# EAGLE design ECGSensor (EAGLE 7.5.0)

## Sheet 1 of 2
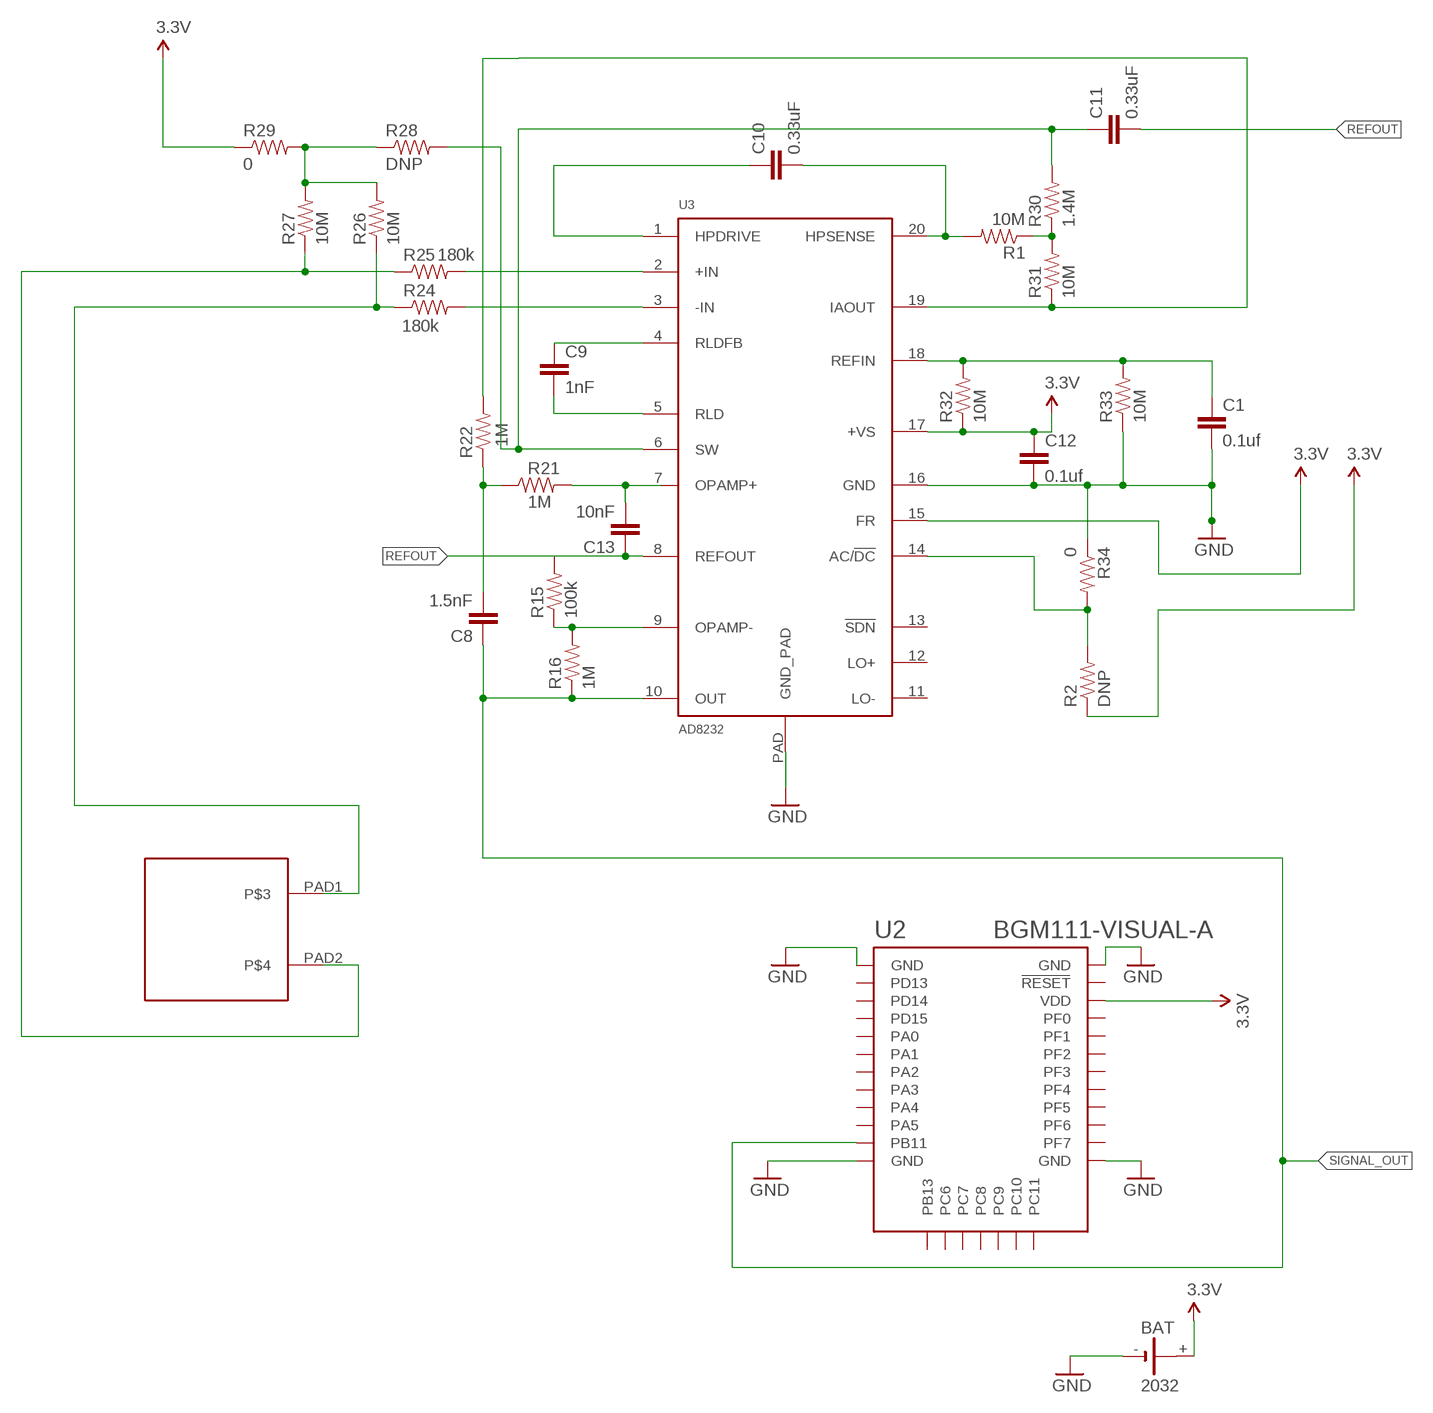
[diagram p0: schematic, sheet 1]

### Parts
BAT  2032  [KZH20SMD]
C1  0.1uf  CAP0603-CAP  [0603-CAP]
C8  1.5nF  CAP0603-CAP  [0603-CAP]
C9  1nF  CAP0603-CAP  [0603-CAP]
C10  0.33uF  CAP0805  [0805]
C11  0.33uF  CAP0805  [0805]
C12  0.1uf  CAP0603-CAP  [0603-CAP]
C13  10nF  CAP0603-CAP  [0603-CAP]
R1  10M  RESISTOR0603-RES  [0603-RES]
R2  DNP  0OHM1/10W5%(0603)  [0603]
R15  100k  RESISTOR0603-RES  [0603-RES]
R16  1M  RESISTOR0603-RES  [0603-RES]
R21  1M  RESISTOR0603-RES  [0603-RES]
R22  1M  RESISTOR0603-RES  [0603-RES]
R24  180k  RESISTOR0603-RES  [0603-RES]
R25  180k  RESISTOR0603-RES  [0603-RES]
R26  10M  RESISTOR0603-RES  [0603-RES]
R27  10M  RESISTOR0603-RES  [0603-RES]
R28  DNP  0OHM1/10W5%(0603)  [0603]
R29  0  0OHM1/10W5%(0603)  [0603]
R30  1.4M  RESISTOR0603-RES  [0603-RES]
R31  10M  RESISTOR0603-RES  [0603-RES]
R32  10M  RESISTOR0603-RES  [0603-RES]
R33  10M  RESISTOR0603-RES  [0603-RES]
R34  0  0OHM1/10W5%(0603)  [0603]
U2  BGM111-VISUAL-A  [BGM111-A]
U3  AD8232  [LFCSP_20]
U$1  CPAD  [SNAPPAD]

### Nets
3.3V: BAT.+ C12.1 R2.1 R29.1 R32.1 U2.VDD U3.15(FR) U3.17(+VS)
GND: BAT.- C1.2 C12.2 R33.1 R34.1 U2.GND U2.GND@2(GND) U2.GND@3(GND) U2.GND@4(GND) U3.16(GND) U3.PAD(GND_PAD)
LA: U$1.PAD2
N$2: C10.1 U3.1(HPDRIVE)
N$6: C10.2 R1.2 U3.20(HPSENSE)
N$7: R1.1 R30.1 R31.2
N$8: C11.1 R28.2 R30.2 U3.6(SW)
N$10: C1.1 R32.2 R33.2 U3.18(REFIN)
N$11: R22.2 R31.1 U3.19(IAOUT)
N$17: C9.2 U3.5(RLD)
N$19: R2.2 R34.2 U3.14(AC/!DC)
N$20: C8.2 R21.1 R22.1
N$21: C13.2 R21.2
N$22: C9.1 U3.4(RLDFB)
N$23: R24.2 U3.3(-IN)
N$24: R25.2 U3.2(+IN)
N$25: R25.1 R27.1
N$26: R24.1 R26.1 U$1.PAD1
N$28: R26.2 R27.2 R28.1 R29.2
N$29: R15.1 R16.2 U3.9(OPAMP-)
N$31: C13.1 R15.2 U3.8(REFOUT)
N$33: C11.2
SIGNAL_OUT: C8.1 R16.1 U2.PB11 U3.10(OUT)
Unconnected: U2.PA0 U2.PA1 U2.PA2 U2.PA3 U2.PA4 U2.PA5 U2.PB13 U2.PC6 U2.PC7 U2.PC8 U2.PC9 U2.PC10 U2.PC11 U2.PD13 U2.PD14 U2.PD15 U2.PF0 U2.PF1 U2.PF2 U2.PF3 U2.PF4 U2.PF5 U2.PF6 U2.PF7 U2.RESET U3.7(OPAMP+) U3.11(LO-) U3.12(LO+) U3.13(!SDN)

## Sheet 2 of 2

## Library data of the parts
BAT = SMTU-2032-1:2032
C1 C8-C13 = SparkFun-Passives:CAP: Capacitor Standard 0603 ceramic capacitor, and 0.1" leaded capacitor.
R1 R15 R16 R21 R22 R24-R27 R30-R33 = SparkFun-Passives:RESISTOR: Resistor Basic schematic elements and footprints for 0603, 1206, and PTH resistors.
R2 R28 = SparkFun-Resistors:0OHM1/10W5%(0603): RES-08609; PROD_ID: RES-08609; VALUE: 0
R29 R34 = SparkFun-Resistors:0OHM1/10W5%(0603): RES-08609; PROD_ID: RES-08609
U2 = sf-bluegiga:BGM111-VISUAL: Bluetooth 4.1 (4.2 ready) low-energy module (Bluetooth Smart) - BGM111-A variant has an on-module ceramic chip antenna. BGM111-A variant includes keepout/restrict area. Antenna edge of the module should be flush up against the edge of the PCB. See datasheet for variant layout details. IT IS EXTREMELY IMPORTANT THAT YOU FOLLOW THE LAYOUT GUIDELINES FOR THIS MODULE IN ORDER TO ENSURE MAXIMUM RANGE. THIS MEANS THAT YOU NEED A SOLID GROUND PLANE EXTENDING IDEALLY 17 mm ON THE LEFT AND RIGHT SIDES OF THE MODULE, AS SHOWN IN THE DATASHEET. The Silicon Labs Blue Gecko BGM111 Bluetooth® Smart module integrates our next generation wireless SoC with a complete Bluetooth Smart software stack and antenna to provide a complete, pre-certified plug-and-play Bluetooth Smart solution. It solves one of the major customer roadblocks for fast time-to-market as it integrates antenna, software and RF certifications, saving months of engineering effort and testing. https://www.silabs.com/products/wireless/bluetooth/Pages/BGM111-bluetooth-smart-module.aspx https://github.com/jrowberg/sf-oshw Last updated 2015-09-02 by Jeff Rowberg <jeff@rowberg.net>; ANTENNA: On-module ceramic chip antenna
U3 = AD8232:AD8232
U$1 = Copper pad:CPAD

## Board
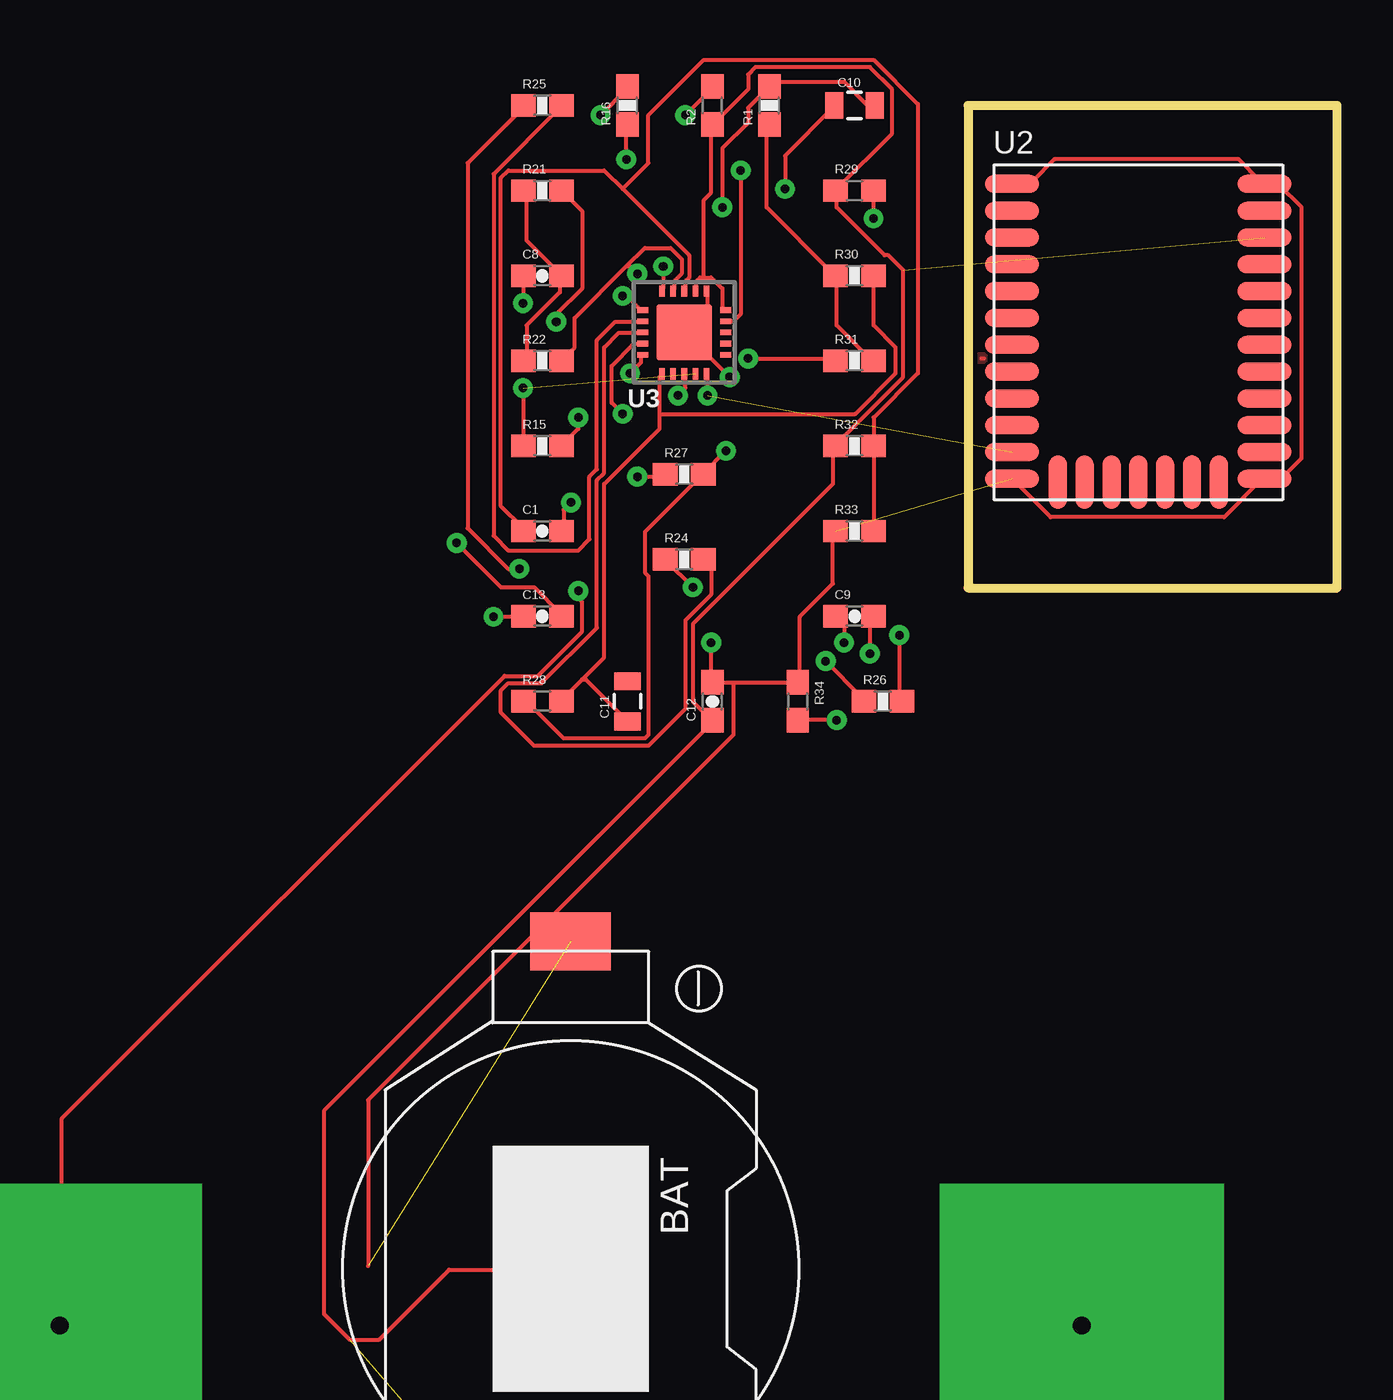
[diagram p1: board, top side]
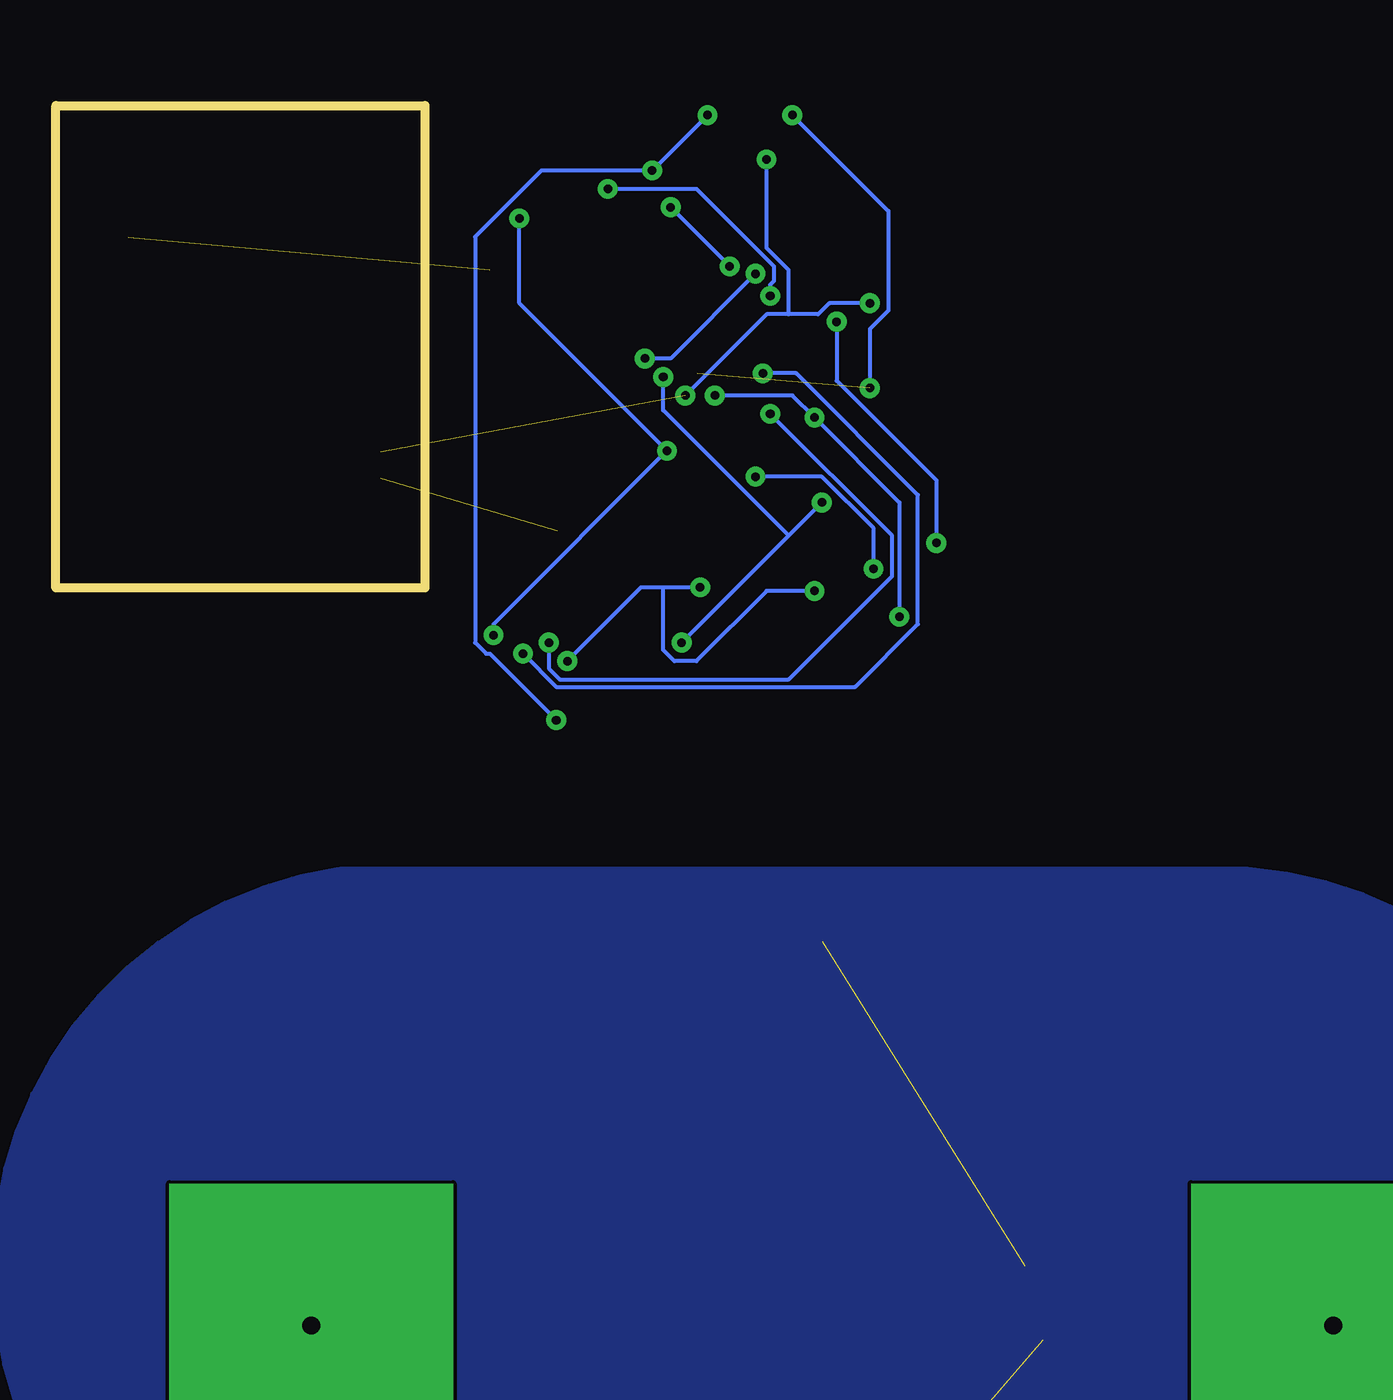
[diagram p2: board, bottom side, seen from below]

Size 16.51 x 21.59 mm. Coordinates in mm from the lower left corner, seen from the top.
Outline: 0,21.59 0,0 16.51,0 16.51,21.59 0,21.59
Copper layers (1*16): Top 0.035mm / dielectric 1.5mm / Bottom 0.035mm
Design rules "default": minimum track width 7mil, minimum drill 15mil, track to track 6mil, track to pad 8mil, pad to pad 8mil, via to via 8mil, smd to smd 8mil, copper to edge 8mil, drill to drill 8mil, minimum pad ring 12mil, minimum via ring 10mil, stop-mask expansion 4mil, vias tented up to drill 20mil, thermal gap 10mil

### Footprints (pad centres in the part's own frame; a part is rotated, then mirrored left to right if it is on the bottom)
KZH20SMD = smd 2.6 x 3.6: + 14.65,0; - -14.65,0
0603-CAP = smd 1.1 x 1: 1 -0.85,0; 2 0.85,0
0805 = smd 0.8 x 1.2: 1 -0.9,0; 2 0.9,0
0603-RES = smd 1.1 x 1: 1 -0.85,0; 2 0.85,0
0603 = smd 1.1 x 1: 1 -0.85,0; 2 0.85,0
BGM111-A = smd 2.4 x 0.8: GND -5.65,6.65; GND@2 -5.65,-6.55; GND@3 5.65,-6.55; GND@4 5.65,6.65; PA0 -5.65,1.85; PA1 -5.65,0.65; PA2 -5.65,-0.55; PA3 -5.65,-1.75; PA4 -5.65,-2.95; PA5 -5.65,-4.15; PB11 -5.65,-5.35; PD13 -5.65,5.45; PD14 -5.65,4.25; PD15 -5.65,3.05; PF0 5.65,-5.35; PF1 5.65,-4.15; PF2 5.65,-2.95; PF3 5.65,-1.75; PF4 5.65,-0.55; PF5 5.65,0.65; PF6 5.65,1.85; PF7 5.65,3.05; RESET 5.65,5.45; VDD 5.65,4.25 | smd 0.8 x 2.4: PB13 -3.6,-6.7; PC6 -2.4,-6.7; PC7 -1.2,-6.7; PC8 0,-6.7; PC9 1.2,-6.7; PC10 2.4,-6.7; PC11 3.6,-6.7
LFCSP_20 = smd 0.5 x 0.25: 1 -1.85,1; 2 -1.85,0.5; 3 -1.85,0; 4 -1.85,-0.5; 5 -1.85,-1; 11 1.85,-1; 12 1.85,-0.5; 13 1.85,0; 14 1.85,0.5; 15 1.85,1 | smd 0.25 x 0.5: 6 -1,-1.85; 7 -0.5,-1.85; 8 0,-1.85; 9 0.5,-1.85; 10 1,-1.85; 16 1,1.85; 17 0.5,1.85; 18 0,1.85; 19 -0.5,1.85; 20 -1,1.85 | smd 2.5 x 2.5: PAD 0,0
SNAPPAD = drill 0.8 pad 12.7 square: PAD1 -50.8,1.27; PAD2 -5.08,1.27

### Placement (x,y rotation side)
BAT  -17.78,-30.48 270 top  (outside the outline)
C1  -19.05,2.54 0 top  (outside the outline)
C8  -19.05,13.97 0 top  (outside the outline)
C9  -5.08,-1.27 0 top  (outside the outline)
C10  -5.08,21.59 0 top  (outside the outline)
C11  -15.24,-5.08 90 top  (outside the outline)
C12  -11.43,-5.08 90 top  (outside the outline)
C13  -19.05,-1.27 0 top  (outside the outline)
R1  -8.89,21.59 90 top  (outside the outline)
R2  -11.43,21.59 90 top  (outside the outline)
R15  -19.05,6.35 0 top  (outside the outline)
R16  -15.24,21.59 90 top  (outside the outline)
R21  -19.05,17.78 0 top  (outside the outline)
R22  -19.05,10.16 0 top  (outside the outline)
R24  -12.7,1.27 0 top  (outside the outline)
R25  -19.05,21.59 0 top  (outside the outline)
R26  -3.81,-5.08 0 top  (outside the outline)
R27  -12.7,5.08 0 top  (outside the outline)
R28  -19.05,-5.08 0 top  (outside the outline)
R29  -5.08,17.78 0 top  (outside the outline)
R30  -5.08,13.97 0 top  (outside the outline)
R31  -5.08,10.16 0 top  (outside the outline)
R32  -5.08,6.35 0 top  (outside the outline)
R33  -5.08,2.54 0 top  (outside the outline)
R34  -7.62,-5.08 270 top  (outside the outline)
U2  7.62,11.43 0 top
U3  -12.7,11.43 0 top  (outside the outline)
U$1  10.16,-34.29 0 top  (outside the outline)

### Tracks (layer width: path | path; a pad name or v marks a point on that pad's centre or on a via)
3.3V  (2 unrouted)
  Top 0.178: -11.82,13.89 -11.99,13.89 -12.15,13.73 -12.15,13.4 U3.17 | -11.82,13.89 -11.49,13.89 -11,13.4 -11,12.41 U3.15 | -11.82,13.89 -11.82,17.36 -11.49,17.69 -11.49,20.66 R2.1 -11.33,20.83 -9.84,22.31 -9.84,22.97 -9.51,23.3 -4.39,23.3 -3.4,22.31 -3.4,20.33 -5.88,17.86 R29.1 -5.88,17.69 -5.88,17.03 -3.73,14.88 -3.57,14.88 -2.91,14.22 -2.91,9.44 -5.88,6.46 R32.1 -6.05,6.3 -6.05,4.65 -12.32,-1.63 -12.32,-5.09 -11.49,-5.92 C12.1 -11.49,-6.08 -28.83,-23.42 -28.83,-32.5 -27.67,-33.66 -26.35,-33.66 -23.22,-30.52 -16.61,-30.52
GND  (via drill 0.38)  (2 unrouted)
  Top 0.178: U2.GND 2.04,18.19 2.87,18.19 3.86,19.18 12.12,19.18 13.11,18.19 U2.GND@4 13.27,18.02 13.93,18.02 14.92,17.03 14.92,5.8 14.1,4.98 13.27,4.98 U2.GND@3 13.11,4.81 11.45,3.16 3.7,3.16 2.04,4.81 U2.GND@2 | U3.16 -11.66,13.23 -11.66,12.57 -12.65,11.58 U3.PAD -12.65,11.42 v-10.67,9.44 | -10.5,-4.27 -7.7,-4.27 R34.1 -7.53,-4.1 -7.53,-1.3 -6.05,0.19 -6.05,2.5 R33.1 | -10.5,-4.27 -11.33,-4.27 C12.2 -11.49,-4.1 v-11.49,-2.45 | v-17.77,3.82 -18.1,3.49 -18.1,2.67 C1.2 | -26.85,-30.35 -26.85,-22.92 -10.5,-6.58 -10.5,-4.27
  Bottom 0.178: v-11.49,-2.45 -16.28,2.34 | -16.28,2.34 v-17.77,3.82 | v-10.67,9.44 -10.67,7.95 -16.28,2.34
N$2  (via drill 0.38)
  Top 0.178: v-15.46,13.07 -15.29,13.07 -14.63,12.41 U3.1 | v-8.19,17.86 -8.19,19.34 -6.05,21.49 C10.1
  Bottom 0.178: v-15.46,13.07 -15.46,13.56 -15.62,13.73 -15.62,14.39 -12.15,17.86 v-8.19,17.86
N$6  (via drill 0.38)
  Top 0.178: v-13.64,14.39 -13.64,13.4 U3.20 | v-11,17.03 -11,19.67 -9.84,20.83 -9.84,21.49 -9.02,22.31 R1.2 -8.85,22.48 -8.69,22.64 -5.55,22.64 -4.56,21.65 -4.23,21.65 C10.2
  Bottom 0.178: v-11,17.03 v-13.64,14.39
N$7
  Top 0.178: R1.1 -9.02,20.66 -9.02,17.03 -6.05,14.06 R30.1 -5.88,13.89 -5.88,11.75 -4.39,10.26 R31.2 -4.23,10.26
N$8
  Top 0.178: -13.8,7.78 -13.8,7.12 -16.28,4.65 -16.28,-3.11 -17.27,-4.1 | -13.8,7.78 -13.8,9.44 U3.6 | -17.27,-4.1 -18.1,-4.93 R28.2 | -13.8,7.78 -5.05,7.78 -3.24,9.6 -3.24,10.76 -4.23,11.75 -4.23,13.89 R30.2 | -17.27,-4.1 -17.11,-4.1 -15.29,-5.92 C11.1
N$10
  Top 0.178: R33.2 -4.23,2.67 -4.23,6.3 R32.2 -4.23,6.46 -4.23,7.62 -2.25,9.6 -2.25,21.65 -4.23,23.64 -11.82,23.64 -14.3,21.16 -14.3,19.01 -15.46,17.86 | -15.46,17.86 -16.28,18.68 -20.57,18.68 -20.9,18.35 -20.9,3.66 -19.91,2.67 C1.1 | -15.46,17.86 -12.48,14.88 -12.48,13.89 -12.65,13.73 -12.65,13.4 U3.18
N$11  (via drill 0.38)
  Top 0.178: -15.29,14.39 -17.6,12.08 -17.6,10.76 -18.1,10.26 R22.2 | -15.29,14.39 -14.47,15.22 -13.31,15.22 -12.81,14.72 -12.81,14.06 -13.14,13.73 -13.14,13.4 U3.19 | v-9.84,10.26 -6.05,10.26 R31.1 | v-14.8,14.06 -15.13,14.39 -15.29,14.39
  Bottom 0.178: v-9.84,10.26 -11,10.26 v-14.8,14.06
N$12
  Top 0.178: 0.72,10.26 0.61,10.26
  pour Bottom: -36.83,-12.7 3.81,-12.7 arc-180 -1.27,-48.26 -34.29,-48.26 arc-180
  pour Top: -27.94,25.4 12.7,25.4 arc-180 7.62,-10.16 -25.4,-10.16 arc-180
N$17  (via drill 0.38)
  Top 0.178: v-15.13,9.6 -14.63,10.1 -14.63,10.43 U3.5 | v-4.39,-2.95 -4.39,-1.3 C9.2
  Bottom 0.178: v-15.13,9.6 -16.61,9.6 -22.06,4.15 -22.06,-1.63 -19.25,-4.43 -5.88,-4.43 v-4.39,-2.95
N$19  (via drill 0.38)
  Top 0.178: v-10.17,18.68 -10.17,12.24 -10.5,11.91 -10.83,11.91 U3.14 | v-12.65,21.16 -11.49,22.31 R2.2 | v-5.88,-5.92 -7.53,-5.92 R34.2
  Bottom 0.178: v-12.65,21.16 v-10.17,18.68 -5.22,18.68 -2.25,15.71 -2.25,-2.45 -2.74,-2.95 -2.91,-2.95 v-5.88,-5.92
N$20
  Top 0.178: R22.1 -19.75,10.26 -19.75,11.75 -18.26,13.23 -18.26,13.89 C8.2 -18.26,14.06 -19.75,15.55 -19.75,17.69 R21.1
N$21  (via drill 0.38)
  Top 0.178: v-22.89,2.01 -20.9,0.02 -19.42,0.02 -18.26,-1.13 C13.2 | v-18.43,11.91 -18.43,12.24 -17.27,13.4 -17.27,16.87 -18.1,17.69 R21.2
  Bottom 0.178: v-22.89,2.01 -22.89,4.81 -18.43,9.27 v-18.43,11.91
N$22  (via drill 0.38)
  Top 0.178: v-15.46,7.78 -15.95,8.28 -15.95,9.93 -14.96,10.92 -14.63,10.92 U3.4 | v-5.55,-2.45 -5.55,-1.63 -5.88,-1.3 C9.1
  Bottom 0.178: v-15.46,7.78 -20.9,2.34 -20.9,0.52 -16.28,-4.1 -6.05,-4.1 -5.55,-3.61 v-5.55,-2.45
N$23
  Top 0.178: U3.3 -14.63,11.42 -15.62,11.42 -16.28,10.76 -16.28,5.14 -16.61,4.81 -16.61,-1.79 -19.09,-4.27 -20.57,-4.27 -20.9,-4.6 -20.9,-5.59 -19.42,-7.07 -14.3,-7.07 -12.65,-5.42 -12.65,-1.46 -11.49,-0.3 -11.49,0.85 -11.82,1.18 R24.2
N$24
  Top 0.178: U3.2 -14.63,11.91 -15.79,11.91 -16.61,11.09 -16.61,5.31 -16.94,4.98 -16.94,2.17 -17.44,1.68 -20.57,1.68 -21.23,2.34 -21.23,18.52 -18.26,21.49 R25.2
N$25  (via drill 0.38)
  Top 0.178: v-14.8,4.98 -13.64,4.98 R27.1 | v-20.08,0.85 -20.57,0.85 -22.39,2.67 -22.39,19.01 -19.91,21.49 R25.1
  Bottom 0.178: v-14.8,4.98 -17.77,4.98 -20.08,2.67 v-20.08,0.85
N$26  (via drill 0.38)
  Top 0.178: v-12.32,0.02 -13.48,1.18 R24.1 | v-6.38,-3.28 -4.72,-4.93 R26.1 | v-17.44,-0.14 -17.44,-0.47 -17.27,-0.64 -17.27,-1.96 -19.25,-3.94 -20.74,-3.94 -40.55,-23.75 -40.55,-33 U$1.PAD1
  Bottom 0.178: -10.67,0.02 -9.68,0.02 v-6.38,-3.28 | -10.67,0.02 v-12.32,0.02 | -10.67,0.02 -10.67,-2.78 -11.16,-3.28 -12.15,-3.28 -15.29,-0.14 v-17.44,-0.14
N$28  (via drill 0.38)
  Top 0.178: R28.1 -19.75,-5.09 -18.1,-6.74 -14.47,-6.74 -14.3,-6.58 -14.3,0.52 -14.47,0.69 -14.47,2.5 -11.99,4.98 R27.2 -11.82,5.14 v-10.83,6.13 | v-4.23,16.53 -4.23,17.69 R29.2 | v-3.07,-2.12 -3.07,-4.93 R26.2
  Bottom 0.178: v-4.23,16.53 -4.23,12.74 v-10.83,6.13 -3.07,-1.63 v-3.07,-2.12
N$29  (via drill 0.38)  (1 unrouted)
  Top 0.178: v-19.91,8.94 -19.91,6.46 R15.1 | v-16.45,21.16 -15.29,22.31 R16.2
  Bottom 0.178: v-19.91,8.94 -19.91,11.58 -20.74,12.41 -20.74,16.87 v-16.45,21.16
N$31  (via drill 0.38)
  Top 0.178: v-12.98,8.61 -12.65,8.94 -12.65,9.44 U3.8 | v-17.44,7.62 -17.44,7.12 -18.1,6.46 R15.2 | v-21.23,-1.3 -19.91,-1.3 C13.1
  Bottom 0.178: v-12.98,8.61 -16.45,8.61 v-17.44,7.62 -21.23,3.82 v-21.23,-1.3
SIGNAL_OUT  (via drill 0.38)  (1 unrouted)
  Top 0.178: v-11.66,8.61 -11.66,9.44 U3.10 | v-19.91,12.74 -19.91,13.89 C8.1 | v-15.29,19.18 -15.29,20.66 R16.1
  Bottom 0.178: v-11.66,8.61 -15.29,12.24 -16.28,12.24 | -16.28,12.24 -17.6,12.24 -18.1,12.74 v-19.91,12.74 | v-15.29,19.18 -15.29,15.22 -16.28,14.22 -16.28,12.24